# EAGLE schematic 1nuc_sluyba (EAGLE 8.5.0)
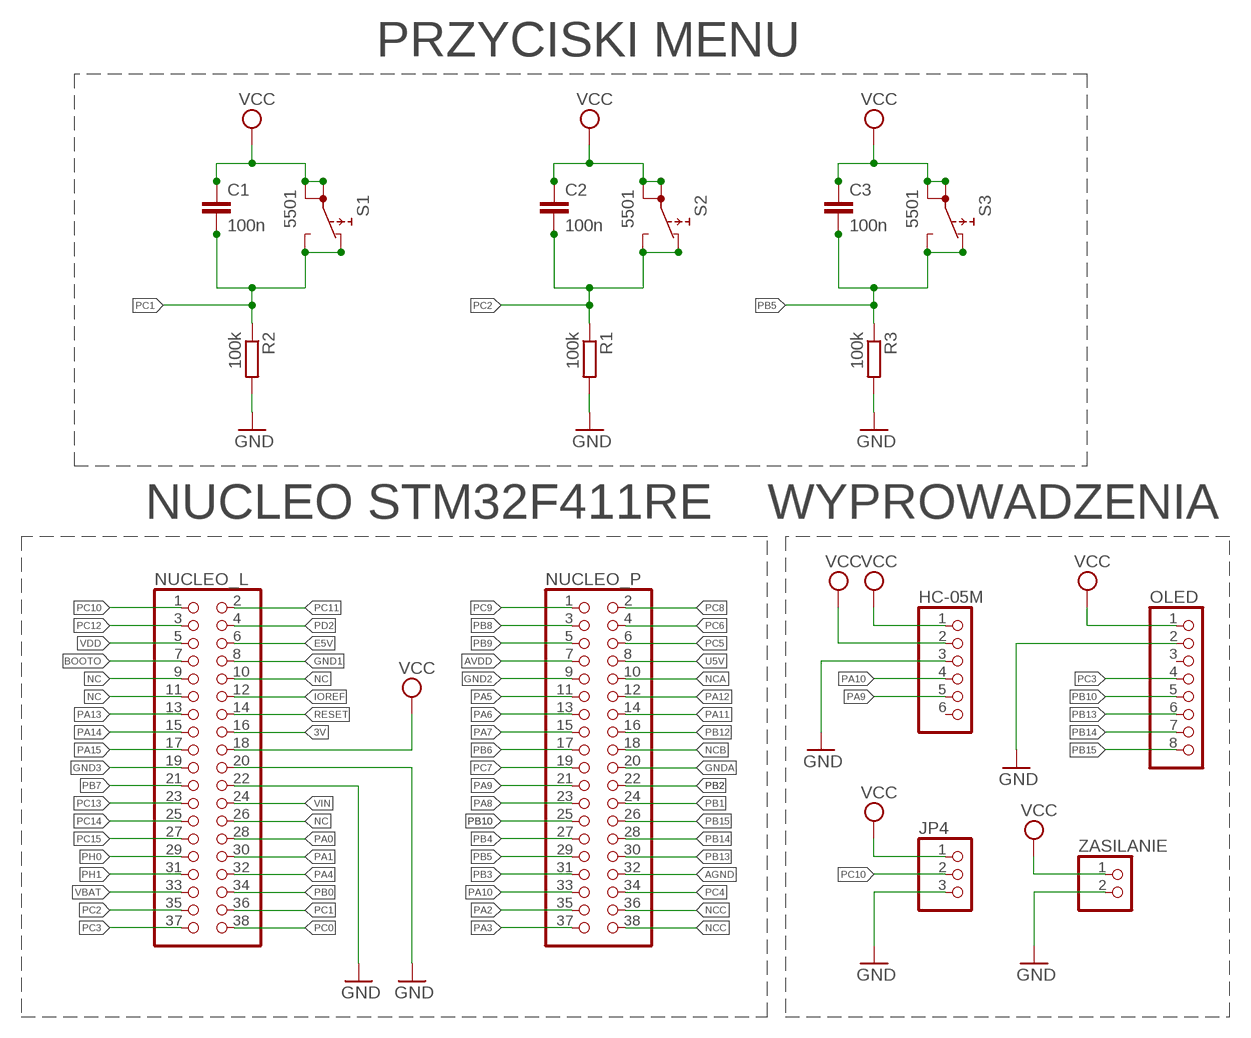
[diagram p0: schematic, sheet 1]

## Parts
C1  100n  C-EUC1206  [C1206]
C2  100n  C-EUC1206  [C1206]
C3  100n  C-EUC1206  [C1206]
HC-05M  PINHD-1X6  [1X06]
JP4  PINHD-1X3  [1X03]
NUCLEO_L  PINHD-2X19  [2X19]
NUCLEO_P  PINHD-2X19  [2X19]
OLED  PINHD-1X8  [1X08]
R1  100k  R-EU_R0805  [R0805]
R2  100k  R-EU_R0805  [R0805]
R3  100k  R-EU_R0805  [R0805]
S1  5501  [5501]
S2  5501  [5501]
S3  5501  [5501]
ZASILANIE  PINHD-1X2  [1X02]

## Nets
3V: NUCLEO_L.16
AGND: NUCLEO_P.32
AVDD: NUCLEO_P.7
BOOTO: NUCLEO_L.7
E5V: NUCLEO_L.6
GND: HC-05M.3 JP4.3 NUCLEO_L.20 NUCLEO_L.22 OLED.2 R1.2 R2.2 R3.2 ZASILANIE.2
GND1: NUCLEO_L.8
GND2: NUCLEO_P.9
GND3: NUCLEO_L.19
GNDA: NUCLEO_P.20
IOREF: NUCLEO_L.12
NC: NUCLEO_L.9 NUCLEO_L.10 NUCLEO_L.11 NUCLEO_L.26
NCA: NUCLEO_P.10
NCB: NUCLEO_P.18
NCC: NUCLEO_P.36 NUCLEO_P.38
PA0: NUCLEO_L.28
PA1: NUCLEO_L.30
PA2: NUCLEO_P.35
PA3: NUCLEO_P.37
PA4: NUCLEO_L.32
PA5: NUCLEO_P.11
PA6: NUCLEO_P.13
PA7: NUCLEO_P.15
PA8: NUCLEO_P.23
PA9: HC-05M.5 NUCLEO_P.21
PA10: HC-05M.4 NUCLEO_P.33
PA11: NUCLEO_P.14
PA12: NUCLEO_P.12
PA13: NUCLEO_L.13
PA14: NUCLEO_L.15
PA15: NUCLEO_L.17
PB0: NUCLEO_L.34
PB1: NUCLEO_P.24
PB2: NUCLEO_P.22
PB3: NUCLEO_P.31
PB4: NUCLEO_P.27
PB5: C3.2 NUCLEO_P.29 R3.1 S3.NC S3.NO
PB6: NUCLEO_P.17
PB7: NUCLEO_L.21
PB8: NUCLEO_P.3
PB9: NUCLEO_P.5
PB10: NUCLEO_P.25 OLED.5
PB12: NUCLEO_P.16
PB13: NUCLEO_P.30 OLED.6
PB14: NUCLEO_P.28 OLED.7
PB15: NUCLEO_P.26 OLED.8
PC0: NUCLEO_L.38
PC1: C1.2 NUCLEO_L.36 R2.1 S1.NC S1.NO
PC2: C2.2 NUCLEO_L.35 R1.1 S2.NC S2.NO
PC3: NUCLEO_L.37 OLED.4
PC4: NUCLEO_P.34
PC5: NUCLEO_P.6
PC6: NUCLEO_P.4
PC7: NUCLEO_P.19
PC8: NUCLEO_P.2
PC9: NUCLEO_P.1
PC10: JP4.2 NUCLEO_L.1
PC11: NUCLEO_L.2
PC12: NUCLEO_L.3
PC13: NUCLEO_L.23
PC14: NUCLEO_L.25
PC15: NUCLEO_L.27
PD2: NUCLEO_L.4
PH0: NUCLEO_L.29
PH1: NUCLEO_L.31
RESET: NUCLEO_L.14
U5V: NUCLEO_P.8
VBAT: NUCLEO_L.33
VCC: C1.1 C2.1 C3.1 HC-05M.1 HC-05M.2 JP4.1 NUCLEO_L.18 OLED.1 S1.1A S1.1B S2.1A S2.1B S3.1A S3.1B ZASILANIE.1
VDD: NUCLEO_L.5
VIN: NUCLEO_L.24
Unconnected: HC-05M.6 OLED.3

## Notes on the sheet
- PRZYCISKI MENU
- NUCLEO STM32F411RE | WYPROWADZENIA

## Library data of the parts
C1-C3 = rcl:C-EU: CAPACITOR, European symbol; SPICEPREFIX: C
HC-05M = pinhead:PINHD-1X6: PIN HEADER
JP4 = pinhead:PINHD-1X3: PIN HEADER
NUCLEO_L NUCLEO_P = pinhead:PINHD-2X19: PIN HEADER
OLED = pinhead:PINHD-1X8: PIN HEADER
R1-R3 = rcl:R-EU_: RESISTOR, European symbol; SPICEPREFIX: R
S1-S3 = switch:55?: PUSHBUTTON SERIES 5500 SWITCHES Source: www.e-switch.com .. 5500.pdf
ZASILANIE = pinhead:PINHD-1X2: PIN HEADER